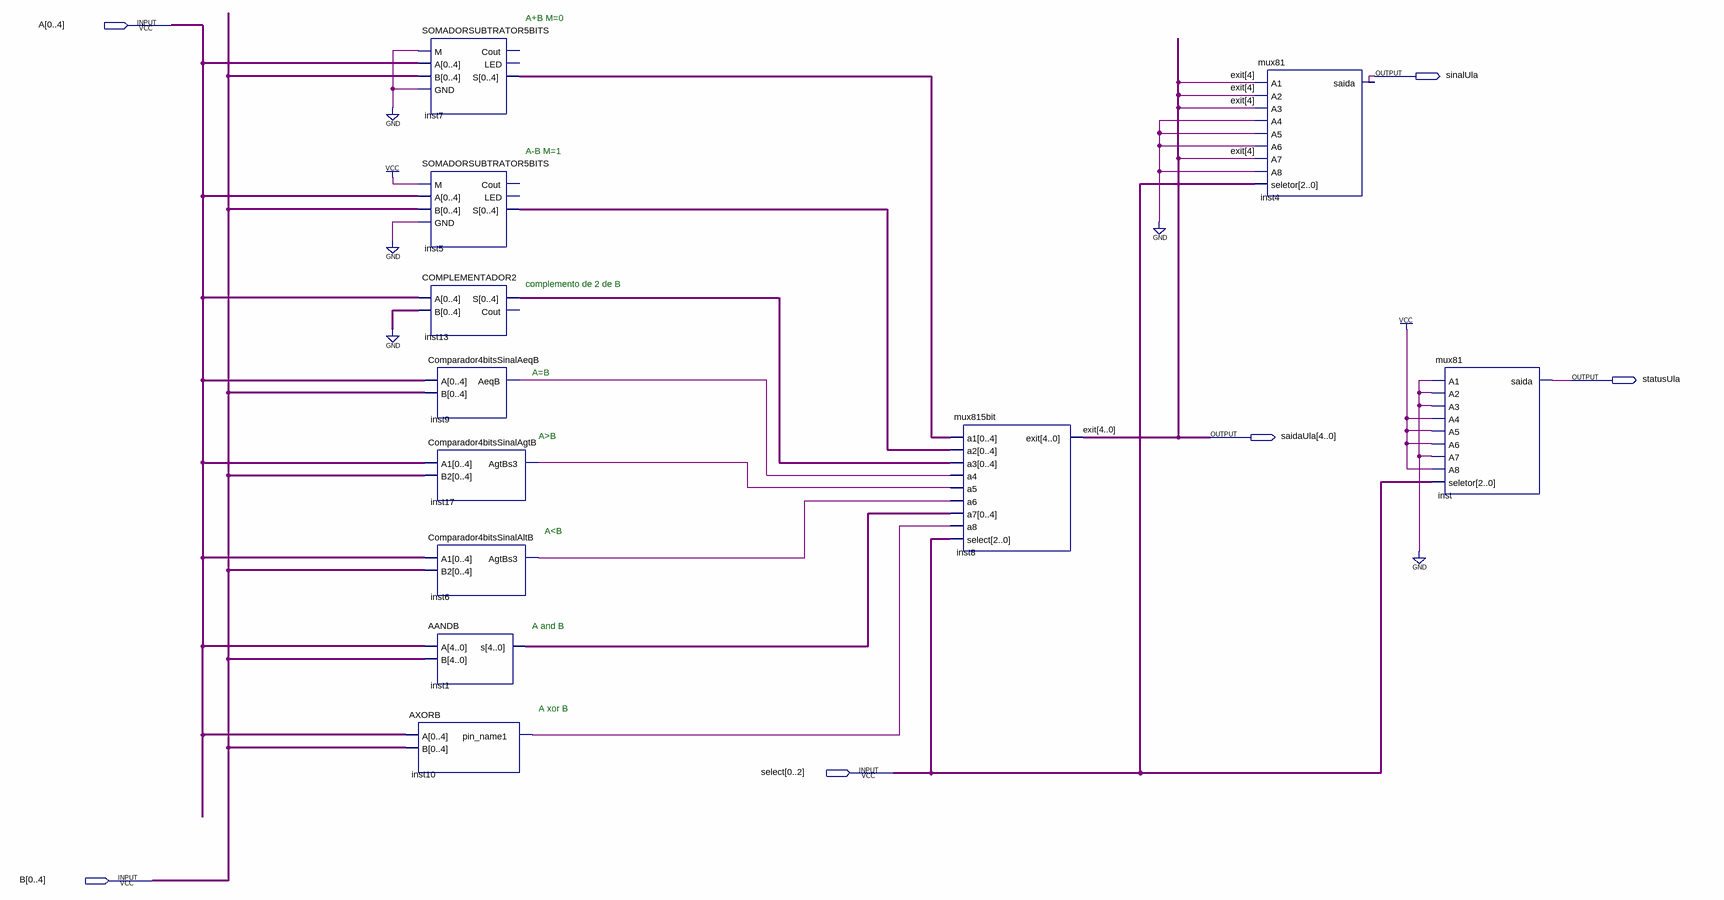
[diagram p0: schematic sheet]
// Quartus schematic projetoULA.bdf as structural Verilog: 11 symbols, 6 pins
module projetoULA (
  input  [0:4] A,
  input  [0:2] select,
  input  [0:4] B,
  output sinalUla,
  output statusUla,
  output [4:0] saidaUla
);

  wire inst6_agtbs3, inst9_aeqb, inst10_pin_name1, inst17_agtbs3;
  wire [4:0] inst1_s, inst5_s, inst7_s, inst13_s;

  AXORB inst10 (.A(A), .B(B), .pin_name1(inst10_pin_name1));
  SOMADORSUBTRATOR5BITS inst7 (.M(1'b0), .A(A), .B(B), .GND(1'b0), .S(inst7_s));  // open: Cout, LED
  SOMADORSUBTRATOR5BITS inst5 (.M(1'b1), .A(A), .B(B), .GND(1'b0), .S(inst5_s));  // open: Cout, LED
  COMPLEMENTADOR2 inst13 (.A(A), .B({5{1'b0}}), .S(inst13_s));  // open: Cout
  Comparador4bitsSinalAeqB inst9 (.A(A), .B(B), .AeqB(inst9_aeqb));
  Comparador4bitsSinalAgtB inst17 (.A1(A), .B2(B), .AgtBs3(inst17_agtbs3));
  Comparador4bitsSinalAltB inst6 (.A1(A), .B2(B), .AgtBs3(inst6_agtbs3));
  AANDB inst1 (.A(A), .B(B), .s(inst1_s));
  mux815bit inst8 (
    .select(select), .a4(inst9_aeqb), .a5(inst17_agtbs3), .a6(inst6_agtbs3), .a8(inst10_pin_name1),
    .a7(inst1_s), .a3(inst13_s), .a2(inst5_s), .a1(inst7_s), .exit(saidaUla));
  mux81 inst4 (
    .A1(saidaUla[4]), .A2(saidaUla[4]), .A3(saidaUla[4]), .A4(1'b0), .A5(1'b0), .A6(1'b0), .A7(saidaUla[4]),
    .A8(1'b0), .seletor(select), .saida(sinalUla));
  mux81 inst (
    .A1(1'b0), .A2(1'b0), .A3(1'b0), .A4(1'b1), .A5(1'b1), .A6(1'b1), .A7(1'b0), .A8(1'b1), .seletor(select),
    .saida(statusUla));

  // Other names for the same wires on the sheet: exit[4:0] = saidaUla

  // Notes on the sheet:
  //   A+B M=0
  //   A-B M=1
  //   complemento de 2 de B
  //   A=B
  //   A>B
  //   A<B
  //   A and B
  //   A xor B
endmodule
